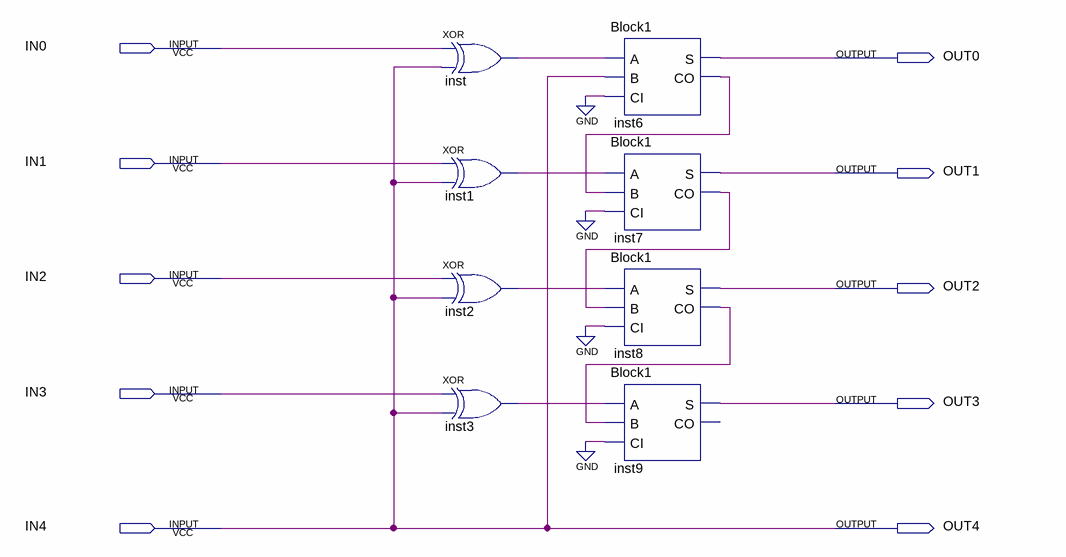
[diagram p0: schematic sheet]
// Quartus schematic Complement5.bdf as structural Verilog: 8 symbols, 10 pins
module Complement5 (
  input  IN0,
  input  IN1,
  input  IN2,
  input  IN3,
  input  IN4,
  output OUT0,
  output OUT1,
  output OUT2,
  output OUT3,
  output OUT4
);

  wire inst1_out, inst2_out, inst3_out, inst6_co, inst7_co, inst8_co, inst_out;

  xor inst (inst_out, IN0, IN4);
  xor inst1 (inst1_out, IN1, IN4);
  xor inst2 (inst2_out, IN2, IN4);
  xor inst3 (inst3_out, IN3, IN4);
  Block1 inst6 (.A(inst_out), .B(IN4), .CI(1'b0), .S(OUT0), .CO(inst6_co));
  Block1 inst7 (.A(inst1_out), .B(inst6_co), .CI(1'b0), .S(OUT1), .CO(inst7_co));
  Block1 inst8 (.A(inst2_out), .B(inst7_co), .CI(1'b0), .S(OUT2), .CO(inst8_co));
  Block1 inst9 (.A(inst3_out), .B(inst8_co), .CI(1'b0), .S(OUT3));  // open: CO

  assign OUT4 = IN4;
endmodule
